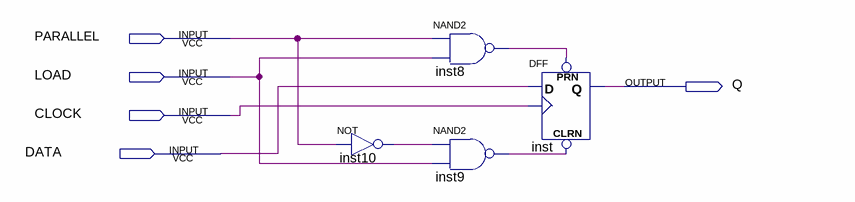
[diagram p0: schematic sheet]
// Quartus schematic REGISTER_1bit.bdf as structural Verilog: 4 symbols, 5 pins
module REGISTER_1bit (
  input  PARALLEL,
  input  LOAD,
  input  CLOCK,
  input  DATA,
  output Q
);

  wire inst8_out, inst9_out, inst10_out;

  not inst10 (inst10_out, PARALLEL);
  nand inst8 (inst8_out, PARALLEL, LOAD);
  nand inst9 (inst9_out, inst10_out, LOAD);
  DFF inst (.CLRN(inst9_out), .CLK(CLOCK), .D(DATA), .PRN(inst8_out), .Q(Q));
endmodule
